# Altium schematic sheet ALARM.SchDoc: Alarm and sound
size B; Author: Sebastien Gelinas; CompanyName: SmartHalo; Organization: SmartHalo; Address1: 5445 de Gaspé; Address2: Montréal, QC; Address3: Canada; Address4: H2T 3B2; Revision: 1; SheetNumber: 5; SheetTotal: 5
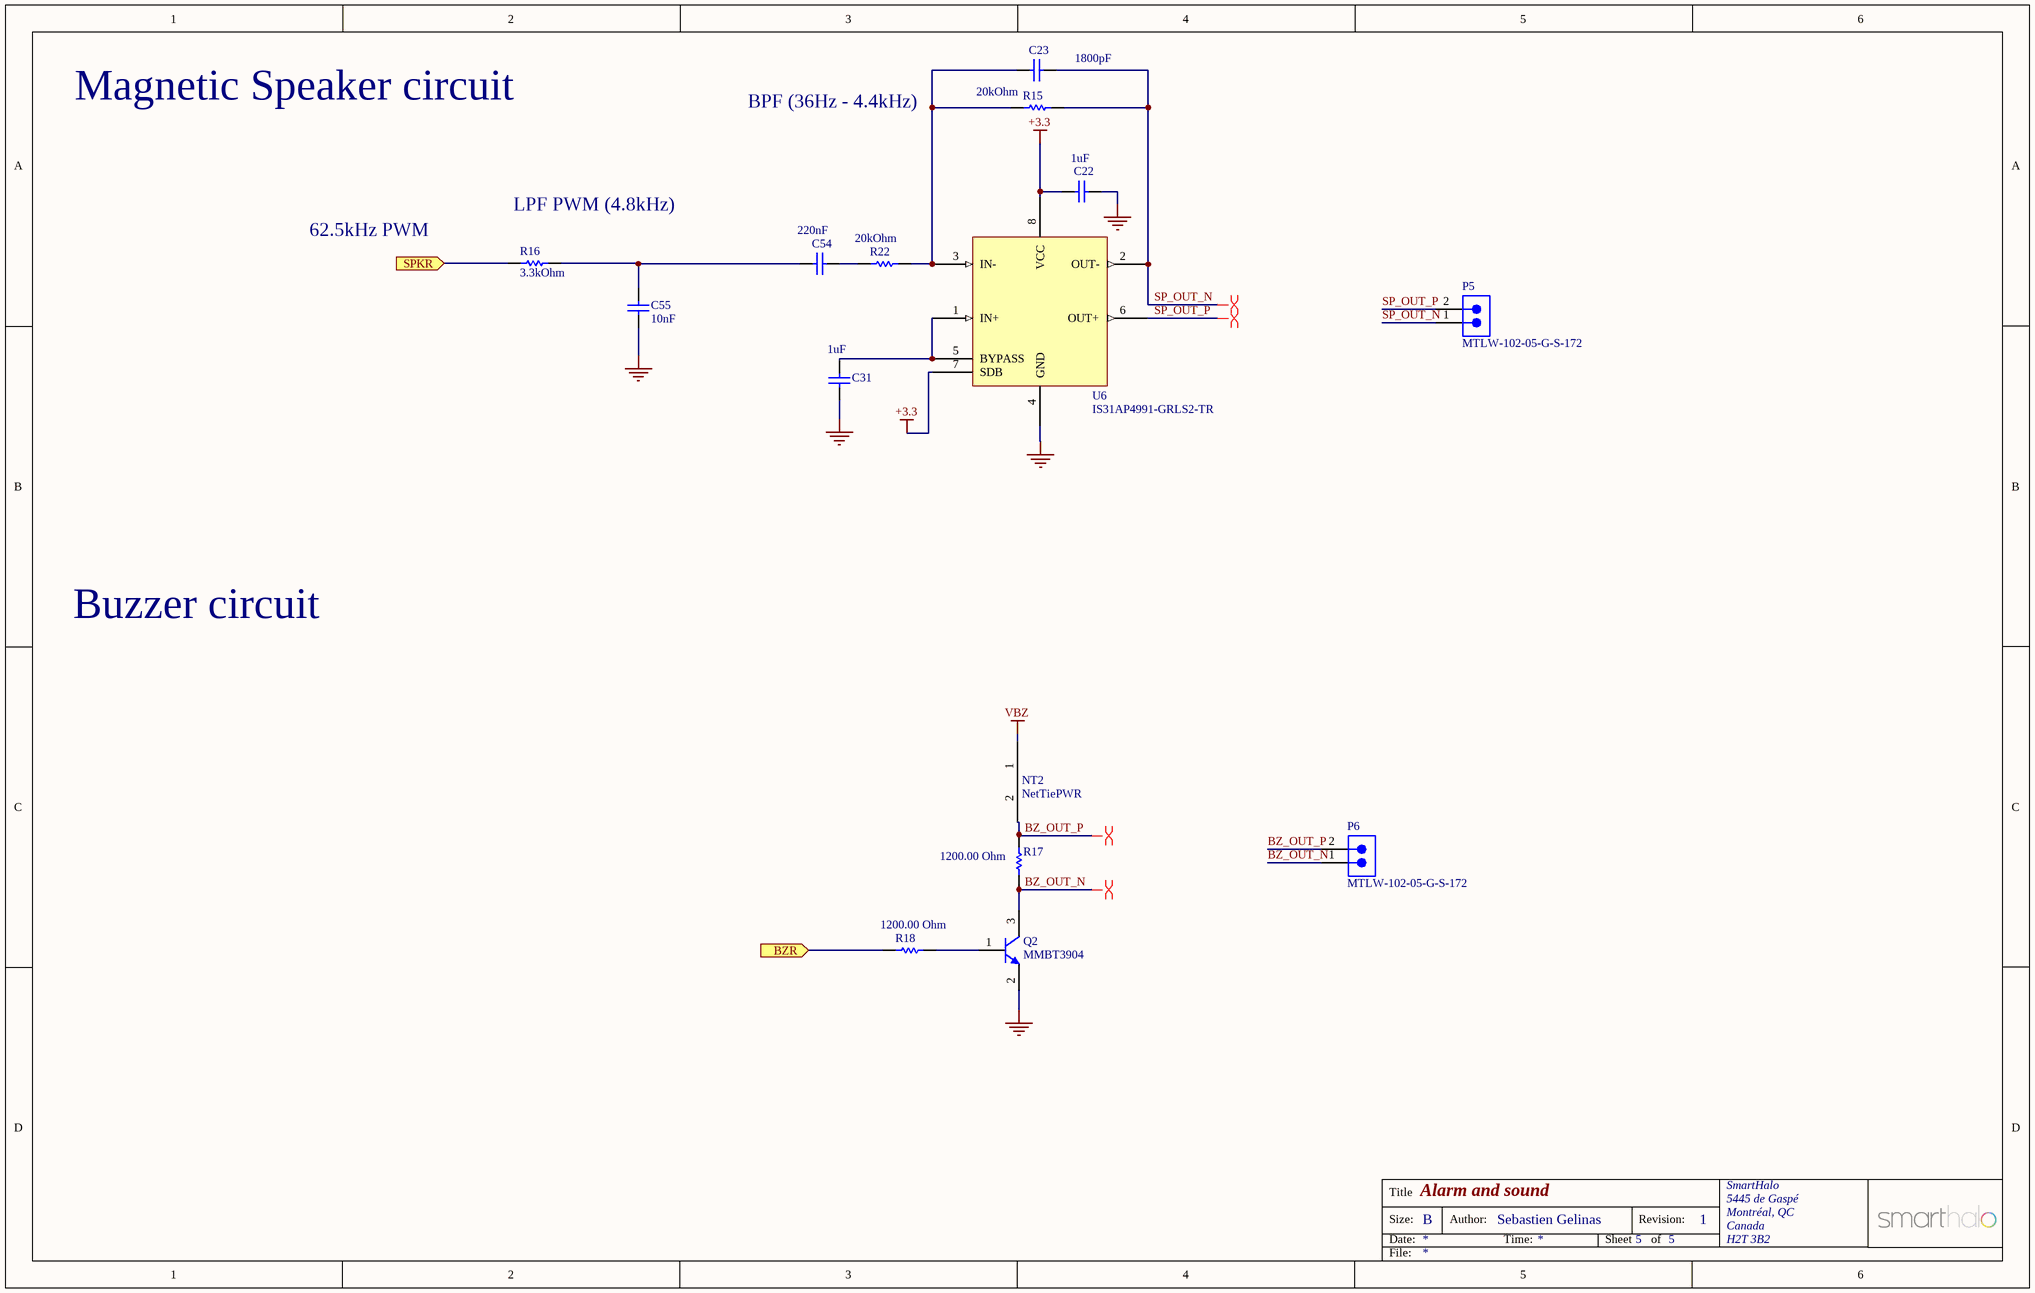
[diagram p0: ALARM.SchDoc]

## Parts
C22  Capacitance: 1uF  [CAPC0402(1005)60_L]  (hidden comment: CAP 1uF 6.3V 0402(1005))
C23  Capacitance: 1800pF  [CAPC0402(1005)60_N]  (hidden comment: CAP 1800pF 6.3V 0402(1005))
C31  Capacitance: 1uF  [CAPC0402(1005)60_L]  (hidden comment: CAP 1uF 6.3V 0402(1005))
C54  Capacitance: 220nF  [CAPC0402(1005)60_N]  (hidden comment: CAP 220nF 6.3V 0402(1005))
C55  Capacitance: 10nF  [CAPC0402(1005)60_N]  (hidden comment: CAP 10nF 6.3V 0402(1005))
NT2  NetTiePWR  [NetTiePWR]  (net tie, no BOM)
P5  MTLW-102-05-G-S-172  [SMTC-MTLW-102-05-X-S-172]  (no BOM)
P6  MTLW-102-05-G-S-172  [SMTC-MTLW-102-05-X-S-172]  (no BOM)
Q2  MMBT3904  [INF-SOT23_L]
R15  Resistance: 20kOhm  [RESC0402(1005)_M]  (hidden comment: 20K 5% 0402(1005))
R16  Resistance: 3.3kOhm  [RESC0402(1005)_M]  (hidden comment: 3K3 5% 0402(1005))
R17  Resistance: 1200.00 Ohm  [RESC0402(1005)_N]  (hidden comment: 1K2 ±5% 0402(1005))
R18  Resistance: 1200.00 Ohm  [RESC0402(1005)_N]  (hidden comment: 1K2 5% 0402(1005))
R22  Resistance: 20kOhm  [RESC0402(1005)_M]  (hidden comment: 20K 5% 0402(1005))
U6  IS31AP4991-GRLS2-TR  [SOP8]

## Ports
BZR, SPKR

## Nets
+3.3: C22.2 U6.7(SDB) U6.8(VCC)
GND: C22.1 C31.1 C55.1 Q2.2(E) U6.4(GND)
VBZ: NT2.1(NET1)
BZ_OUT_N: P6.1 Q2.3(C) R17.1
BZ_OUT_P: NT2.2(NET2) P6.2 R17.2
BZR: R18.1 ; port BZR
SP_OUT_N: C23.2 P5.1 R15.2 U6.2(OUT-)
SP_OUT_P: P5.2 U6.6(OUT+)
SPKR: R16.2 ; port SPKR
NetC23_1: C23.1 R15.1 R22.2 U6.3(IN-)
NetC31_2: C31.2 U6.1(IN+) U6.5(BYPASS)
NetC54_1: C54.1 C55.2 R16.1
NetC54_2: C54.2 R22.1
NetQ2_1: Q2.1(B) R18.2

## Layout directives
differential pair: BZ_OUT_N, BZ_OUT_P, SP_OUT_N, SP_OUT_P

## Notes on the sheet
- Magnetic Speaker circuit
- BPF (36Hz - 4.4kHz)
- 62.5kHz PWM
- (near R16) LPF PWM (4.8kHz)
- Buzzer circuit
- Title
- Size:
- Date:
- B
- Author:
- Time:
- Sheet
- Revision:
- of
- File:

## Library data of the parts
C22 C31 = CMP-1034-02113-1: CAP 1uF 6.3V ±10% 0402 (1005 Metric); Case-Metric: 1005; Case-EIA: 0402; Tolerance: ±10%; Rated Voltage: 6.3 V
C23 = CMP-1034-01350-1: CAP 1800pF 6.3V ±10% 0402 (1005 Metric); Case-Metric: 1005; Case-EIA: 0402; Tolerance: ±10%; Rated Voltage: 6.3 V
C54 = CMP-1034-01350-1: CAP 220nF 6.3V ±10% 0402 (1005 Metric); Case-Metric: 1005; Case-EIA: 0402; Tolerance: ±10%; Rated Voltage: 6.3 V
C55 = CMP-1034-01350-1: CAP 10nF 6.3V ±10% 0402 (1005 Metric); Case-Metric: 1005; Case-EIA: 0402; Max Thickness: 0.6 mm; Tolerance: ±10%; Rated Voltage: 6.3 V; Technology: SMT
P5 P6 = CMP-1024-00064-1: Low Profile .025" SQ Post Header, Through-hole, Vertical, -55 to 125 degC, 2.54 mm Pitch, 2-Pin, Male, RoHS; Manufacturer: Samtec; Pitch: 2.54 mm; ComponentLink2URL: http://www.samtec.com/documents/webfiles/pdf/MTLW_TH.PDF; PackageDescription: Low Profile Terminal Assembly; ComponentLink3URL: http://www.samtec.com/documents/webfiles/cpdf/MTLW-1XX-XX-XX-X-XXX-XX-XX-MKT1.pdf; PackageReference: MTLW-102-05-X-S-172; Mounting Technology: Through-hole; ComponentLink2Description: Datasheet; PackageVersion: T, 6/1991; Orientation: Vertical; DatasheetVersion: F-214; RoHS: True; ComponentLink3Description: Package Specification; ComponentLink1URL: http://www.samtec.com; Temperature Range: -55 to 125 degC; PartNumber: MTLW-102-05-G-S-172; ComponentLink1Description: Manufacturer URL
Q2 = CMP-1178-00008-1: NPN Silicon Switching Transistor, 40 V VCEO, 200 mA IC, SOT23, Reel, Green; Manufacturer: Infineon; IC (max): 200 mA; VCBO (max): 60 V; VCE (max): 1 V; Green: TRUE; ICBO (max): 50 nA; IC: 10 mA; VCEO (max): 40 V; VEBO (max): 6 V; ComponentLink3Description: Package Specification; ComponentLink2Description: Datasheet; PackageDescription: 3-Pin Small Outline Transistor Package, 1.3 x 2.9 mm Body, 0.95 mm Pitch; Packing: Reel; ComponentLink1Description: Manufacturer URL; Polarity: NPN; ComponentLink3URL: http://www.infineon.com/dgdl/SOT23-Package_Overview.pdf?folderId=db3a30431936bc4b0119532290053c66&fileId=db3a30431936bc4b0119533468123c85; PackageReference: SOT23; Mounting Technology: Surface Mount; VCE: 1 V; ComponentLink2URL: http://www.infineon.com/dgdl/smbt3904series_mmbt3904.pdf?folderId=db3a30431441fb5d011445fab851018e&fileId=db3a30431441fb5d0114460005c10191; PartNumber: MMBT3904; PackageVersion: Apr-08; ComponentLink1URL: http://www.infineon.com/
R15 R22 = CMP-1011-00105-1: 20K 0.063W ±5% 0402 (1005 Metric); Case-EIA: 0402; Case-Metric: 1005; Tolerance: ±5 %; Power: 0.063 W
R16 = CMP-1011-00105-1: 3K3 0.063W ±5% 0402 (1005 Metric)  SMD; Case-EIA: 0402; Case-Metric: 1005; Tolerance: ±5 %; Power: 0.063 W
R17 = CMP-1011-00076-1: 1K2 0.063W ±5% 0402 (1005 Metric); Case-Metric: 1005; Case-EIA: 0402; Power: 0.063 W; Tolerance: ±5 %
R18 = CMP-1011-00076-1: 1K2 0.063W ±5% 0402 (1005 Metric)  SMD; Case-Metric: 1005; Case-EIA: 0402; Power: 0.063 W; Tolerance: ±5 %
U6 = IS31AP4991-GRLS2-TR: IC AUDIO AMP MONO 1.2W 8SOP